# EAGLE design main (EAGLE 8.6.3)
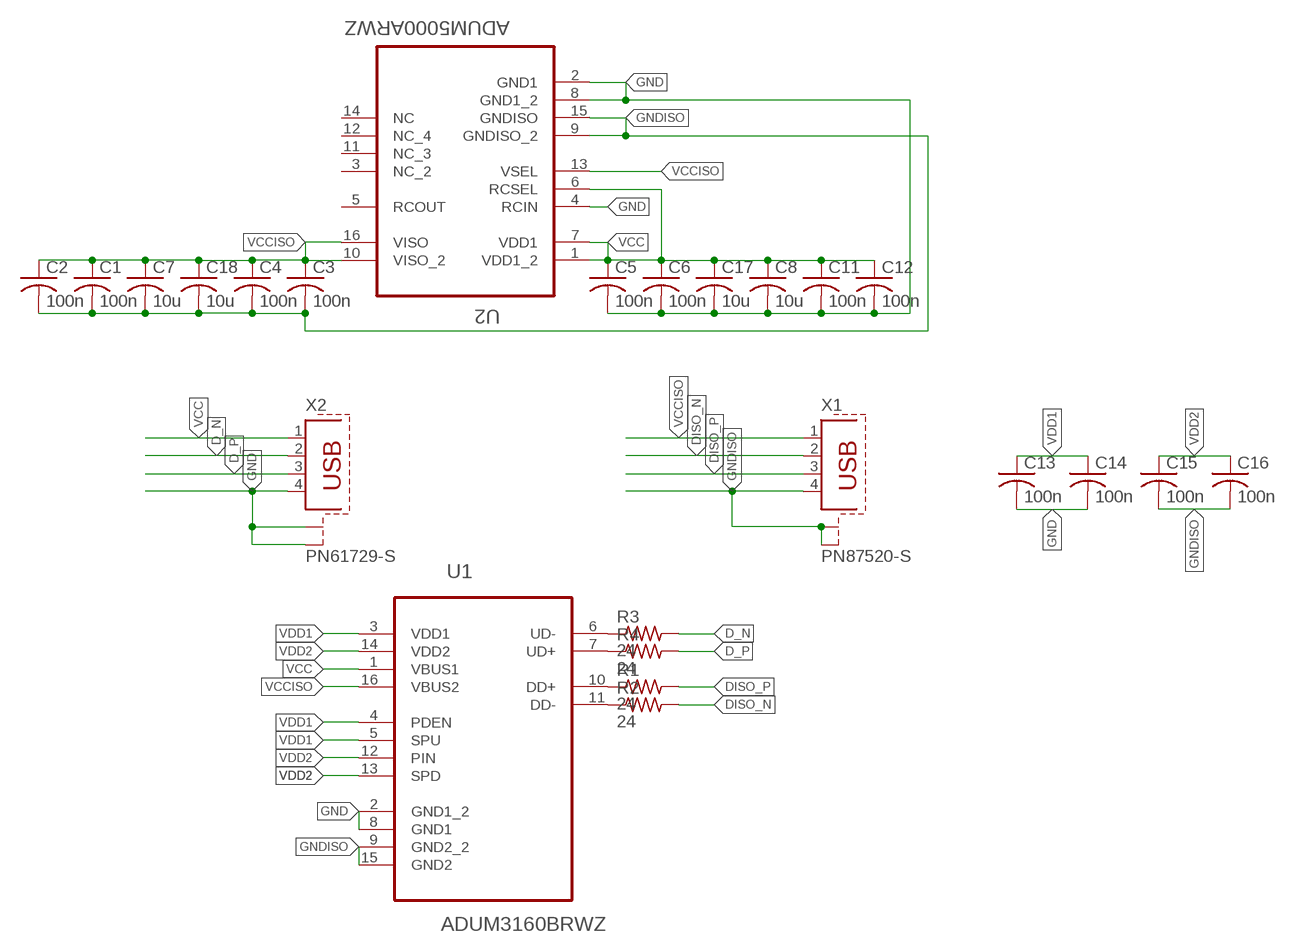
[diagram p0: schematic, sheet 1]

## Parts
C1  100n  C-USC0603  [C0603]
C2  100n  C-USC0603  [C0603]
C3  100n  C-USC0603  [C0603]
C4  100n  C-USC0603  [C0603]
C5  100n  C-USC0603  [C0603]
C6  100n  C-USC0603  [C0603]
C7  10u  C-US025-025X050  [C025-025X050]
C8  10u  C-US025-025X050  [C025-025X050]
C11  100n  C-USC0603  [C0603]
C12  100n  C-USC0603  [C0603]
C13  100n  C-USC0603  [C0603]
C14  100n  C-USC0603  [C0603]
C15  100n  C-USC0603  [C0603]
C16  100n  C-USC0603  [C0603]
C17  10u  C-US025-025X050  [C025-025X050]
C18  10u  C-US025-025X050  [C025-025X050]
R1  24  R-US_R0603  [R0603]
R2  24  R-US_R0603  [R0603]
R3  24  R-US_R0603  [R0603]
R4  24  R-US_R0603  [R0603]
U1  ADUM3160BRWZ  [SOIC127P1032X265-16N]
U2  ADUM5000ARWZ  [SOIC127P1032X265-16N]
X1  PN87520-S  [PN87520-S]
X2  PN61729-S  [PN61729-S]

## Nets
D_N: R3.2 X2.2
D_P: R4.2 X2.3
DISO_N: R2.2 X1.2
DISO_P: R1.2 X1.3
GND: C5.2 C6.2 C8.2 C11.2 C12.2 C13.2 C14.2 C17.2 U1.2(GND1_2) U1.8(GND1) U2.2(GND1) U2.4(RCIN) U2.8(GND1_2) X2.4 X2.S1 X2.S2
GNDISO: C1.2 C2.2 C3.2 C4.2 C7.2 C15.2 C16.2 C18.2 U1.9(GND2_2) U1.15(GND2) U2.9(GNDISO_2) U2.15(GNDISO) X1.4 X1.S1 X1.S2
N$1: R1.1 U1.10(DD+)
N$2: R2.1 U1.11(DD-)
N$5: R3.1 U1.6(UD-)
N$6: R4.1 U1.7(UD+)
VCC: C5.1 C6.1 C8.1 C11.1 C12.1 C17.1 U1.1(VBUS1) U2.1(VDD1_2) U2.6(RCSEL) U2.7(VDD1) X2.1
VCCISO: C1.1 C2.1 C3.1 C4.1 C7.1 C18.1 U1.16(VBUS2) U2.10(VISO_2) U2.13(VSEL) U2.16(VISO) X1.1
VDD1: C13.1 C14.1 U1.3(VDD1) U1.4(PDEN) U1.5(SPU)
VDD2: C15.1 C16.1 U1.12(PIN) U1.13(SPD) U1.14(VDD2)
Unconnected: U2.3(NC_2) U2.5(RCOUT) U2.11(NC_3) U2.12(NC_4) U2.14(NC)

## Library data of the parts
C1-C8 C11-C18 = rcl:C-US: CAPACITOR, American symbol; SPICEPREFIX: C
R1-R4 = rcl:R-US_: RESISTOR, American symbol; SPICEPREFIX: R
U1 = 7_segment_lib:ADUM3160BRWZ: Full/Low Speed 2.5 kV USB Digital Isolator; MPN: ADUM3160BRWZ; OC_FARNELL: 1843660; OC_NEWARK: 85R6420; PACKAGE: SOIC-16; SUPPLIER: Analog Devices
U2 = 7_segment_lib:ADUM5000ARWZ: 2.5 kV, Isolated DC-to-DC Converter; MPN: ADUM5000ARWZ; OC_FARNELL: 1701256; OC_NEWARK: 19P8235; PACKAGE: SOIC-16; SUPPLIER: Analog Devices
X1 = 7_segment_lib:PN87520-S; OC_FARNELL: unknown; OC_NEWARK: unknown
X2 = 7_segment_lib:PN61729-S: BERG USB connector; OC_FARNELL: unknown; OC_NEWARK: unknown

## Board
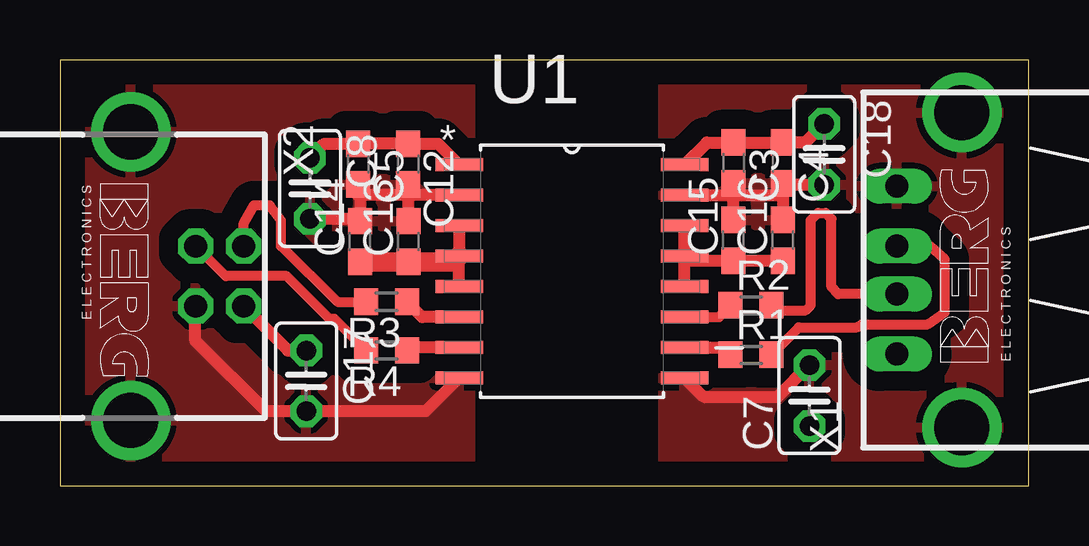
[diagram p1: board, top side]
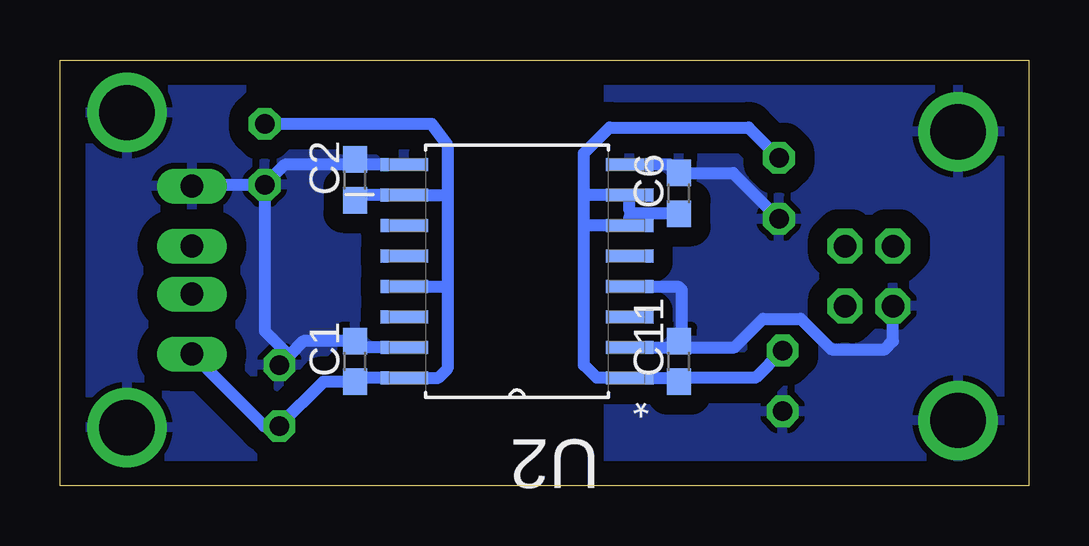
[diagram p2: board, bottom side, seen from below]

Size 40.39 x 17.75 mm. Coordinates in mm from the lower left corner, seen from the top.
Outline: 0,0 40.39,0 40.39,17.75 0,17.75 0,0
Copper layers (1*16): Top 0.035mm / dielectric 1.5mm / Bottom 0.035mm
Design rules "default *": minimum track width 6mil, minimum drill 0.35mm, track to track 12mil, track to pad 12mil, pad to pad 12mil, via to via 12mil, smd to smd 12mil, copper to edge 40mil, drill to drill 6mil, minimum pad ring 10mil, minimum via ring 8mil, stop-mask expansion 4mil, vias tented up to drill 0mil, thermal gap 10mil

### Footprints (pad centres in the part's own frame; a part is rotated, then mirrored left to right if it is on the bottom)
C0603 = smd 1.1 x 1: 1 -0.85,0; 2 0.85,0
C025-025X050 = drill 0.813 octagon: 1 -1.27,0; 2 1.27,0
R0603 = smd 1 x 1.1: 1 -0.85,0; 2 0.85,0
SOIC127P1032X265-16N = smd 1.981 x 0.533: 1 -4.699,4.445; 2 -4.699,3.175; 3 -4.699,1.905; 4 -4.699,0.635; 5 -4.699,-0.635; 6 -4.699,-1.905; 7 -4.699,-3.175; 8 -4.699,-4.445; 9 4.699,-4.445; 10 4.699,-3.175; 11 4.699,-1.905; 12 4.699,-0.635; 13 4.699,0.635; 14 4.699,1.905; 15 4.699,3.175; 16 4.699,4.445
PN87520-S = drill 0.95 long: 1 -3.5,2.71; 2 -1,2.71; 3 1,2.71; 4 3.5,2.71 | drill 2.3 pad 2.9: S1 -6.57,0; S2 6.57,0
PN61729-S = drill 0.95 octagon: 1 1.25,4.71; 2 -1.25,4.71; 3 -1.25,2.71; 4 1.25,2.71 | drill 2.3 pad 2.9: S1 -6.02,0; S2 6.02,0

### Placement (x,y rotation side)
C1  28.1,5.18 90 bottom
C2  28.1,12.75 90 bottom
C3  28.07,13.46 270 top
C4  30.13,13.46 270 top
C5  12.42,13.41 270 top
C6  14.58,12.19 90 bottom
C7  31.25,3.76 90 top
C8  10.42,12.39 270 top
C11  14.58,5.18 90 bottom
C12  14.51,13.41 270 top
C13  14.53,10.18 90 top
C14  12.5,10.18 90 top
C15  28.07,10.24 90 top
C16  30.13,10.24 90 top
C17  10.27,4.37 270 top
C18  31.86,13.82 270 top
R1  28.81,5.46 0 top
R2  28.81,7.52 0 top
R3  13.62,7.67 180 top
R4  13.62,5.64 180 top
U1  21.34,8.94 0 top
U2  21.34,8.94 180 bottom
X1  37.6,8.99 90 top
X2  2.95,8.74 270 top

### Tracks (layer width: path | path; a pad name or v marks a point on that pad's centre or on a via)
D_N
  Top 0.406: R3.2 11.58,7.67 9.21,9.99 9.21,11.06 8.74,11.68 8.08,11.68 7.66,10.96 X2.2
D_P
  Top 0.406: R4.2 11.45,6.96 11.24,6.96 9.46,8.74 6.91,8.74 X2.3
DISO_N
  Top 0.406: R2.2 29.86,7.31 31.09,7.31 31.3,7.52 31.3,11.07 31.6,11.38 31.91,11.38 32.16,11.12 32.16,8.28 32.43,7.99 X1.2
DISO_P
  Top 0.406: R1.2 30.8,6.6 33.23,6.6 33.43,6.73 36.17,6.73 36.88,7.21 36.88,9.45 36.29,9.99 X1.3
GND
  Top 0.508: U1.2 14.53,12.11 | 14.53,12.11 12.58,12.11 12.5,12.04 | 12.5,12.04 C14.2 12.41,11.12 C8.2 | C13.2 14.53,12.11 | C12.2 14.53,12.54 14.53,12.11 | C5.2 12.43,12.11 12.5,12.04 | X2.4 5.59,7.49 5.64,7.44 5.64,6.04 8.59,3.1 C17.2 15.24,3.1 U1.8
  Bottom 0.508: X2.4 5.66,6.03 6,5.69 8.23,5.69 9.5,6.96 11.08,6.96 12.27,5.76 U2.2 14.85,5.76 C11.2 14.48,6.13 14.48,8.18 14.61,8.3 U2.4 | U2.8 14.93,13.38 C6.2 12.33,13.04 C8.2
  pour Top (isolate 0.813): 0,17.5 17.09,17.5 17.09,0 0,0
  pour Bottom (isolate 0.813): 1.02,17.2 17.53,17.2 17.53,0.05 1.02,0.05
GNDISO
  Top 0.508: U1.15 28.15,12.11 | 28.15,12.11 30.1,12.11 | 30.1,12.11 30.13,12.09 C16.2 | 30.1,12.11 30.13,12.14 C4.2 30.19,12.55 C18.2 | C3.2 28.15,12.54 28.15,12.11 | C15.2 28.07,12.04 28.15,12.11 | U1.9 26.83,3.71 29.92,3.71 C7.2
  Bottom 0.508: U2.15 27.83,5.76 C1.2 30.24,6.03 30.84,5.43 | U2.9 27.88,13.38 | 27.88,13.38 C2.2 | X1.4 34.83,12.55 C18.2 | 27.88,13.38 31.02,13.38 C18.2 | 30.84,5.43 C7.2 | C18.2 31.86,6.45 30.84,5.43
  pour Top (isolate 0.813): 25.15,17.2 39.12,17.2 39.12,0.05 25.15,0.05
  pour Bottom (isolate 0.813): 24.52,17.2 39.12,17.2 39.12,0.05 24.52,0.05
N$1
  Top 0.508: U1.10 27.65,5.76 R1.1
N$2
  Top 0.406: U1.11 27.48,7.04 R2.1
N$5
  Top 0.508: U1.6 15.1,7.04 R3.1
N$6
  Top 0.508: U1.7 14.59,5.76 R4.1
VCC
  Top 0.508: U1.1 15.77,14.26 C12.1 C5.1 11.01,14.26 C8.1 | X2.1 9.51,5.64 C17.1
  Bottom 0.508: C6.1 16.53,11.34 | 16.53,11.34 16.64,11.46 U2.7 18.42,12.11 18.55,11.99 | 16.53,11.34 16.64,11.23 U2.6 18.42,10.84 18.55,10.97 | 14.75,4.49 U2.1 18.01,4.49 18.55,5.03 18.55,10.97 | 14.75,4.49 C11.1 | C17.1 11.41,4.49 14.75,4.49 | C8.1 11.69,14.93 17.48,14.93 18.55,13.87 18.55,11.99 | 18.55,10.97 18.55,11.99
VCCISO
  Top 0.508: U1.16 26.96,14.31 C3.1 C4.1 31.08,14.31 C18.1
  Bottom 0.508: C2.1 27.88,12.11 U2.10 24.24,12.11 | C18.1 24.9,15.09 24.24,14.17 24.24,12.11 | 24.24,12.11 24.24,8.3 | 24.24,8.3 24.24,4.88 24.62,4.49 U2.16 27.93,4.49 C1.1 29.4,4.33 C7.1 31.88,2.49 X1.1 | U2.13 24.24,8.3
VDD1
  Top 0.508: U1.5 U1.4 U1.3
  Top 0.813: C14.1 C13.1 16.4,9.34 U1.4
VDD2
  Top 0.508: U1.13 U1.14 | U1.12 U1.13 | U1.13 26.23,9.38 C15.1 C16.1